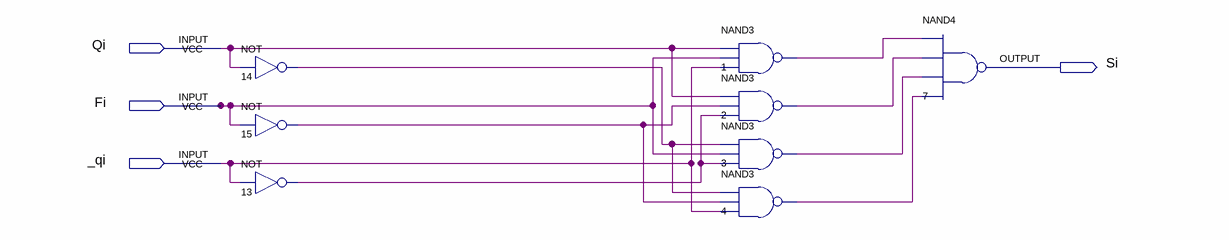
[diagram p0: schematic sheet]
// Quartus schematic FSUM.bdf as structural Verilog: 8 symbols, 4 pins
module FSUM (
  input  Qi,
  input  Fi,
  input  _qi,
  output Si
);

  wire n1_out, n2_out, n3_out, n4_out, n13_out, n14_out, n15_out;

  not u_14 (n14_out, Qi);
  not u_15 (n15_out, Fi);
  not u_13 (n13_out, _qi);
  nand u_1 (n1_out, Qi, Fi, _qi);
  nand u_2 (n2_out, Qi, n15_out, n13_out);
  nand u_3 (n3_out, n14_out, Fi, n13_out);
  nand u_4 (n4_out, n14_out, n15_out, _qi);
  nand u_7 (Si, n1_out, n2_out, n3_out, n4_out);
endmodule
